# EAGLE design WaldoRevB (EAGLE 7.6.0)
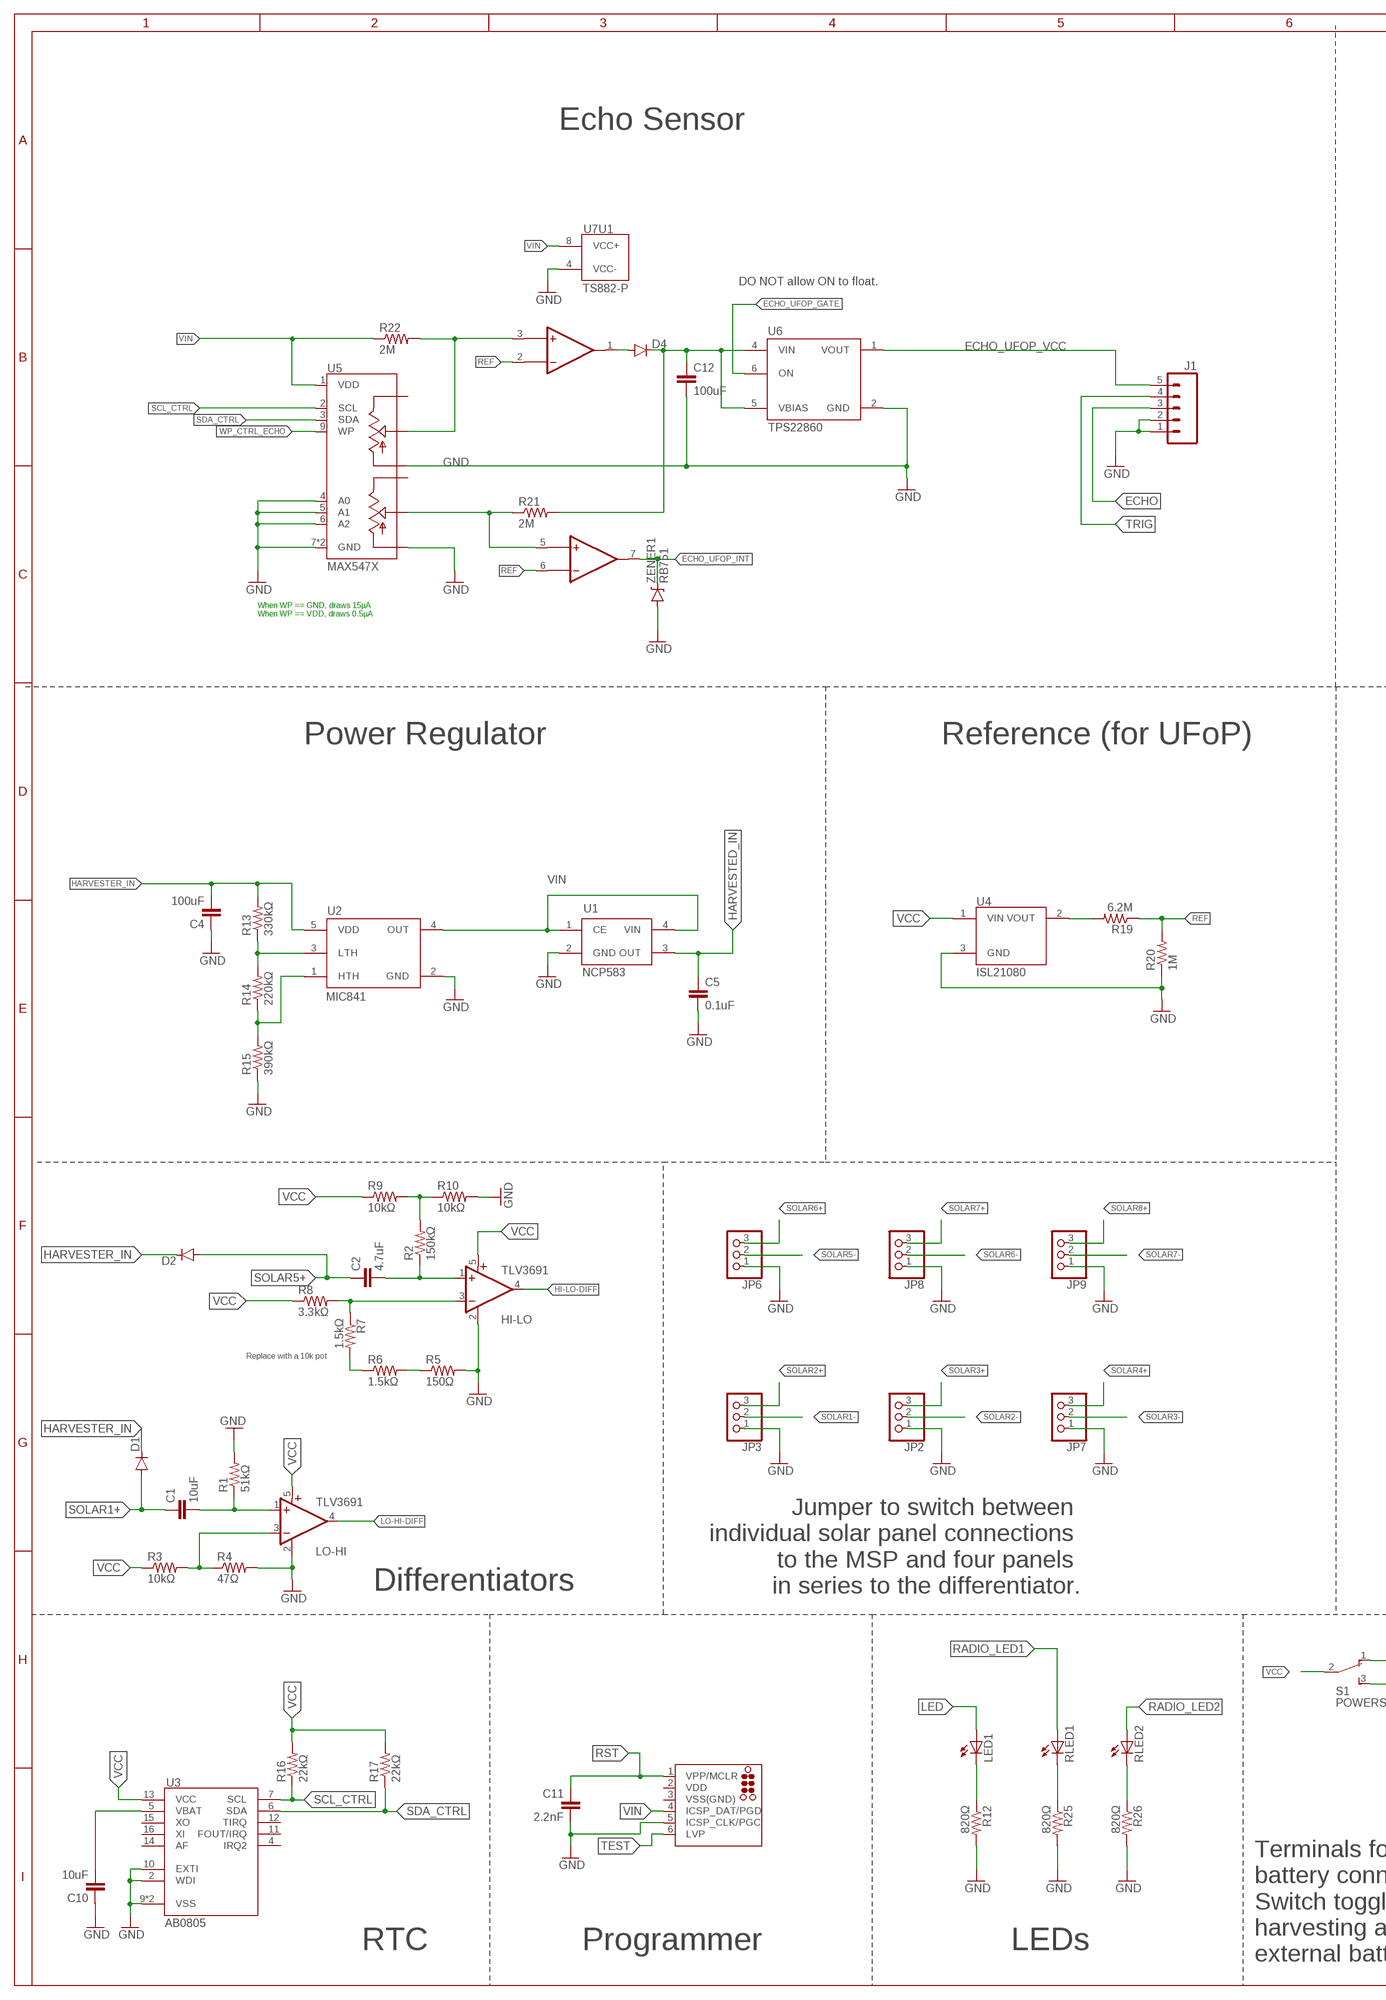
[diagram p0: schematic, sheet 1, part 1 of 2]
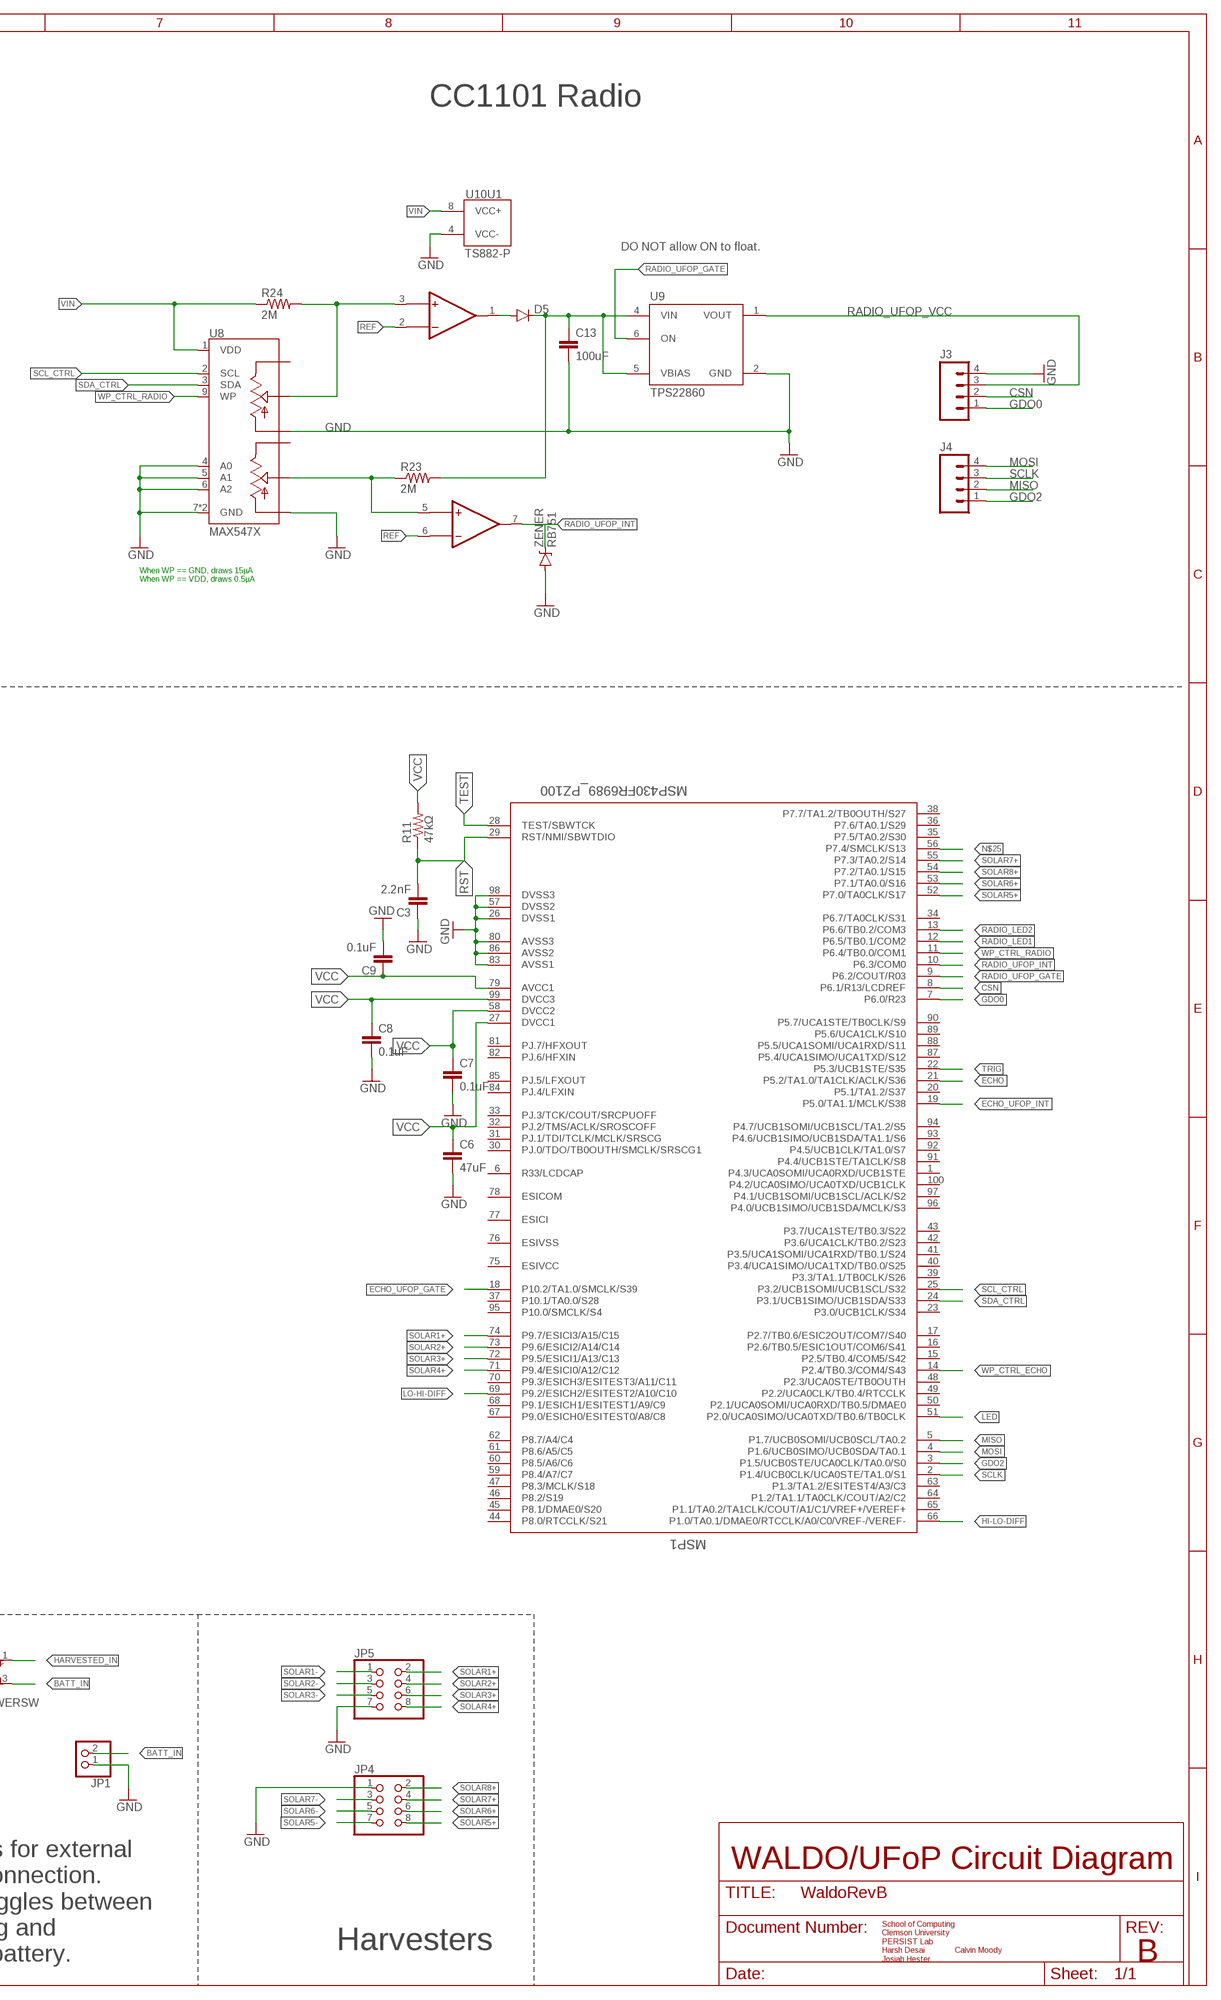
[diagram p1: schematic, sheet 1, part 2 of 2]

## Parts
C1  10uF  CAP0805  [0805]
C2  4.7uF  CAP0805  [0805]
C3  2.2nF  CAP0805  [0805]
C4  100uF  CAP0805  [0805]
C5  0.1uF  CAP0805  [0805]
C6  47uF  CAP0805  [0805]
C7  0.1uF  CAP0805  [0805]
C8  0.1uF  CAP0805  [0805]
C9  0.1uF  CAP0805  [0805]
C10  10uF  CAP0805  [0805]
C11  2.2nF  CAP0805  [0805]
C12  100uF  CAP0805  [0805]
C13  100uF  CAP0805  [0805]
D1  DIODESOD523  [SOD523]
D2  DIODESOD523  [SOD523]
D4  DIODESOD523  [SOD523]
D5  DIODESOD523  [SOD523]
HI-LO  TLV3691  [SC70-5]
J1  M05PTH  [1X05]
J2  TC2030-MCP-NL  [TC2030-MCP-NL]
J3  M04PTH  [1X04]
J4  M04PTH  [1X04]
JP1  PINHD-1X2  [1X02]
JP2  PINHD-1X3  [1X03]
JP3  PINHD-1X3  [1X03]
JP4  PINHD-2X4  [2X04]
JP5  PINHD-2X4  [2X04]
JP6  PINHD-1X3  [1X03]
JP7  PINHD-1X3  [1X03]
JP8  PINHD-1X3  [1X03]
JP9  PINHD-1X3  [1X03]
LED1  LEDCHIP-LED0805  [CHIP-LED0805]
LO-HI  TLV3691  [SC70-5]
MSP1  MSP430FR6989_PZ100  [PZ100]
R1  51kΩ  RESISTOR0805-RES  [0805]
R2  150kΩ  RESISTOR0805-RES  [0805]
R3  10kΩ  RESISTOR0805-RES  [0805]
R4  47Ω  RESISTOR0805-RES  [0805]
R5  150Ω  RESISTOR0805-RES  [0805]
R6  1.5kΩ  RESISTOR0805-RES  [0805]
R7  1.5kΩ  RESISTOR0805-RES  [0805]
R8  3.3kΩ  RESISTOR0805-RES  [0805]
R9  10kΩ  RESISTOR0805-RES  [0805]
R10  10kΩ  RESISTOR0805-RES  [0805]
R11  47kΩ  RESISTOR0805-RES  [0805]
R12  820Ω  RESISTOR0805-RES  [0805]
R13  330kΩ  RESISTOR0805-RES  [0805]
R14  220kΩ  RESISTOR0805-RES  [0805]
R15  390kΩ  RESISTOR0805-RES  [0805]
R16  22kΩ  RESISTOR0805-RES  [0805]
R17  22kΩ  RESISTOR0805-RES  [0805]
R19  6.2M  RESISTOR0805-RES  [0805]
R20  1M  RESISTOR0805-RES  [0805]
R21  2M  RESISTOR0805-RES  [0805]
R22  2M  RESISTOR0805-RES  [0805]
R23  2M  RESISTOR0805-RES  [0805]
R24  2M  RESISTOR0805-RES  [0805]
R25  820Ω  RESISTOR0805-RES  [0805]
R26  820Ω  RESISTOR0805-RES  [0805]
RLED1  LEDCHIP-LED0805  [CHIP-LED0805]
RLED2  LEDCHIP-LED0805  [CHIP-LED0805]
S1  POWERSW  [TL3XYO]
U1  NCP583  [SC82-AB_1PRIMARY]
U2  MIC841  [SC70-5]
U3  AB0805  [QFN16]
U4  ISL21080  [SOT-23]
U5  MAX547X  [QFN16]
U6  TPS22860  [TSOT23-6]
U7  TS882-P  [UDFN8]
U8  MAX547X  [QFN16]
U9  TPS22860  [TSOT23-6]
U10  TS882-P  [UDFN8]
ZENER  RB751  DIODE-ZENER  [SOD-523]
ZENER1  RB751  DIODE-ZENER  [SOD-523]

## Nets
BATT_IN: JP1.2 S1.3(S)
CSN: J3.2 MSP1.8(P6.1/R13/LCDREF)
ECHO: J1.3 MSP1.21(P5.2/TA1.0/TA1CLK/ACLK/S36)
ECHO_UFOP_GATE: MSP1.18(P10.2/TA1.0/SMCLK/S39) U6.6(ON)
ECHO_UFOP_INT: MSP1.19(P5.0/TA1.1/MCLK/S38) U7.7(OP2:OUT1) ZENER1.CATHODE(C)
ECHO_UFOP_VCC: J1.5 U6.1(VOUT)
GDO0: J3.1 MSP1.7(P6.0/R23)
GDO2: J4.1 MSP1.3(P1.5/UCB0STE/UCA0CLK/TA0.0/S0)
GND: C3.1 C4.1 C5.2 C6.2 C7.2 C8.2 C9.2 C10.1 C11.2 C12.2 C13.2 HI-LO.2(GND) J1.1 J1.2 J2.5(ICSP_CLK/PGC) J3.4 JP1.1 JP2.1 JP3.1 JP4.1 JP5.7 JP6.1 JP7.1 JP8.1 JP9.1 LO-HI.2(GND) MSP1.26(DVSS1) MSP1.57(DVSS2) MSP1.80(AVSS3) MSP1.83(AVSS1) MSP1.86(AVSS2) MSP1.98(DVSS3) R1.2 R4.2 R5.2 R10.2 R12.2 R15.1 R20.1 R25.2 R26.2 U1.2(GND) U2.2(GND) U3.2(WDI) U3.9(VSS) U3.10(EXTI) U3.TH(VSS) U4.3(GND) U5.4(A0) U5.5(A1) U5.6(A2) U5.7(GND) U5.10(LB) U5.13(LA) U5.TH(GND) U6.2(GND) U7.4(U1:VCC-) U8.4(A0) U8.5(A1) U8.6(A2) U8.7(GND) U8.10(LB) U8.13(LA) U8.TH(GND) U9.2(GND) U10.4(U1:VCC-) ZENER1.ANODE(A) ZENER.ANODE(A)
HARVESTED_IN: C5.1 S1.1(O) U1.3(OUT)
HARVESTER_IN: C4.2 D1.C D2.C R13.2 U2.5(VDD)
HI-LO-DIFF: HI-LO.4(OUT) MSP1.66(P1.0/TA0.1/DMAE0/RTCCLK/A0/C0/VREF-/VEREF-)
LED: LED1.A MSP1.51(P2.0/UCA0SIMO/UCA0TXD/TB0.6/TB0CLK)
LO-HI-DIFF: LO-HI.4(OUT) MSP1.69(P9.2/ESICH2/ESITEST2/A10/C10)
MISO: J4.2 MSP1.5(P1.7/UCB0SOMI/UCB0SCL/TA0.2)
MOSI: J4.4 MSP1.4(P1.6/UCB0SIMO/UCB0SDA/TA0.1)
N$1: C1.2 LO-HI.1(+IN) R1.1
N$2: C2.2 HI-LO.1(+IN) R2.1
N$3: LO-HI.3(-IN) R3.2 R4.1
N$4: R5.1 R6.2
N$5: R6.1 R7.2
N$6: HI-LO.3(-IN) R7.1 R8.2
N$7: LED1.C R12.1
N$8: R2.2 R9.2 R10.1
N$9: R25.1 RLED1.C
N$11: R13.1 R14.2 U2.3(LTH)
N$12: R14.1 R15.2 U2.1(HTH)
N$13: C10.2 U3.5(VBAT)
N$14: R19.2 U4.2(VOUT)
N$16: R22.2 U5.14(WA) U7.3(OP1:IN1+)
N$17: C12.1 D4.C R21.2 U6.4(VIN) U6.5(VBIAS)
N$18: R21.1 U5.11(WB) U7.5(OP2:IN1+)
N$20: D4.A U7.1(OP1:OUT1)
N$21: R24.2 U8.14(WA) U10.3(OP1:IN1+)
N$22: C13.1 D5.C R23.2 U9.4(VIN) U9.5(VBIAS)
N$23: R23.1 U8.11(WB) U10.5(OP2:IN1+)
N$24: D5.A U10.1(OP1:OUT1)
N$25: MSP1.56(P7.4/SMCLK/S13)
RADIO_LED1: MSP1.12(P6.5/TB0.1/COM2) RLED1.A
RADIO_LED2: MSP1.13(P6.6/TB0.2/COM3) RLED2.A
RADIO_UFOP_GATE: MSP1.9(P6.2/COUT/R03) U9.6(ON)
RADIO_UFOP_INT: MSP1.10(P6.3/COM0) U10.7(OP2:OUT1) ZENER.CATHODE(C)
RADIO_UFOP_VCC: J3.3 U9.1(VOUT)
REF: R19.1 R20.2 U7.2(OP1:IN1-) U7.6(OP2:IN1-) U10.2(OP1:IN1-) U10.6(OP2:IN1-)
RLED2: R26.1 RLED2.C
RST: C3.2 C11.1 J2.1(VPP/MCLR) MSP1.29(RST/NMI/SBWTDIO) R11.1
SCL_CTRL: MSP1.25(P3.2/UCB1SOMI/UCB1SCL/S32) R16.1 U3.7(SCL) U5.2(SCL) U8.2(SCL)
SCLK: J4.3 MSP1.2(P1.4/UCB0CLK/UCA0STE/TA1.0/S1)
SDA_CTRL: MSP1.24(P3.1/UCB1SIMO/UCB1SDA/S33) R17.1 U3.6(SDA) U5.3(SDA) U8.3(SDA)
SOLAR1+: C1.1 D1.A JP5.2 MSP1.74(P9.7/ESICI3/A15/C15)
SOLAR1-: JP3.2 JP5.1
SOLAR2+: JP3.3 JP5.4 MSP1.73(P9.6/ESICI2/A14/C14)
SOLAR2-: JP2.2 JP5.3
SOLAR3+: JP2.3 JP5.6 MSP1.72(P9.5/ESICI1/A13/C13)
SOLAR3-: JP5.5 JP7.2
SOLAR4+: JP5.8 JP7.3 MSP1.71(P9.4/ESICI0/A12/C12)
SOLAR5+: C2.1 D2.A JP4.8 MSP1.52(P7.0/TA0CLK/S17)
SOLAR5-: JP4.7 JP6.2
SOLAR6+: JP4.6 JP6.3 MSP1.53(P7.1/TA0.0/S16)
SOLAR6-: JP4.5 JP8.2
SOLAR7+: JP4.4 JP8.3 MSP1.55(P7.3/TA0.2/S14)
SOLAR7-: JP4.3 JP9.2
SOLAR8+: JP4.2 JP9.3 MSP1.54(P7.2/TA0.1/S15)
TEST: J2.6(LVP) MSP1.28(TEST/SBWTCK)
TRIG: J1.4 MSP1.22(P5.3/UCB1STE/S35)
VCC: C6.1 C7.1 C8.1 C9.1 HI-LO.5(V+) LO-HI.5(V+) MSP1.27(DVCC1) MSP1.58(DVCC2) MSP1.79(AVCC1) MSP1.99(DVCC3) R3.1 R8.1 R9.1 R11.2 R16.2 R17.2 S1.2(P) U3.13(VCC) U4.1(VIN)
VIN: J2.4(ICSP_DAT/PGD) R22.1 R24.1 U1.1(CE) U1.4(VIN) U2.4(OUT) U5.1(VDD) U7.8(U1:VCC+) U8.1(VDD) U10.8(U1:VCC+)
WP_CTRL_ECHO: MSP1.14(P2.4/TB0.3/COM4/S43) U5.9(WP)
WP_CTRL_RADIO: MSP1.11(P6.4/TB0.0/COM1) U8.9(WP)
Unconnected: MSP1.1(P4.3/UCA0SOMI/UCA0RXD/UCB1STE) MSP1.6(R33/LCDCAP) MSP1.15(P2.5/TB0.4/COM5/S42) MSP1.16(P2.6/TB0.5/ESIC1OUT/COM6/S41) MSP1.17(P2.7/TB0.6/ESIC2OUT/COM7/S40) MSP1.20(P5.1/TA1.2/S37) MSP1.23(P3.0/UCB1CLK/S34) MSP1.30(PJ.0/TDO/TB0OUTH/SMCLK/SRSCG1) MSP1.31(PJ.1/TDI/TCLK/MCLK/SRSCG) MSP1.32(PJ.2/TMS/ACLK/SROSCOFF) MSP1.33(PJ.3/TCK/COUT/SRCPUOFF) MSP1.34(P6.7/TA0CLK/S31) MSP1.35(P7.5/TA0.2/S30) MSP1.36(P7.6/TA0.1/S29) MSP1.37(P10.1/TA0.0/S28) MSP1.38(P7.7/TA1.2/TB0OUTH/S27) MSP1.39(P3.3/TA1.1/TB0CLK/S26) MSP1.40(P3.4/UCA1SIMO/UCA1TXD/TB0.0/S25) MSP1.41(P3.5/UCA1SOMI/UCA1RXD/TB0.1/S24) MSP1.42(P3.6/UCA1CLK/TB0.2/S23) MSP1.43(P3.7/UCA1STE/TB0.3/S22) MSP1.44(P8.0/RTCCLK/S21) MSP1.45(P8.1/DMAE0/S20) MSP1.46(P8.2/S19) MSP1.47(P8.3/MCLK/S18) MSP1.48(P2.3/UCA0STE/TB0OUTH) MSP1.49(P2.2/UCA0CLK/TB0.4/RTCCLK) MSP1.50(P2.1/UCA0SOMI/UCA0RXD/TB0.5/DMAE0) MSP1.59(P8.4/A7/C7) MSP1.60(P8.5/A6/C6) MSP1.61(P8.6/A5/C5) MSP1.62(P8.7/A4/C4) MSP1.63(P1.3/TA1.2/ESITEST4/A3/C3) MSP1.64(P1.2/TA1.1/TA0CLK/COUT/A2/C2) MSP1.65(P1.1/TA0.2/TA1CLK/COUT/A1/C1/VREF+/VEREF+) MSP1.67(P9.0/ESICH0/ESITEST0/A8/C8) MSP1.68(P9.1/ESICH1/ESITEST1/A9/C9) MSP1.70(P9.3/ESICH3/ESITEST3/A11/C11) MSP1.75(ESIVCC) MSP1.76(ESIVSS) MSP1.77(ESICI) MSP1.78(ESICOM) MSP1.81(PJ.7/HFXOUT) MSP1.82(PJ.6/HFXIN) MSP1.84(PJ.4/LFXIN) MSP1.85(PJ.5/LFXOUT) MSP1.87(P5.4/UCA1SIMO/UCA1TXD/S12) MSP1.88(P5.5/UCA1SOMI/UCA1RXD/S11) MSP1.89(P5.6/UCA1CLK/S10) MSP1.90(P5.7/UCA1STE/TB0CLK/S9) MSP1.91(P4.4/UCB1STE/TA1CLK/S8) MSP1.92(P4.5/UCB1CLK/TA1.0/S7) MSP1.93(P4.6/UCB1SIMO/UCB1SDA/TA1.1/S6) MSP1.94(P4.7/UCB1SOMI/UCB1SCL/TA1.2/S5) MSP1.95(P10.0/SMCLK/S4) MSP1.96(P4.0/UCB1SIMO/UCB1SDA/MCLK/S3) MSP1.97(P4.1/UCB1SOMI/UCB1SCL/ACLK/S2) MSP1.100(P4.2/UCA0SIMO/UCA0TXD/UCB1CLK) U3.4(IRQ2) U3.11(FOUT/IRQ) U3.12(TIRQ) U3.14(AF) U3.15(XO) U3.16(XI) U5.12(HB) U5.15(HA) U8.12(HB) U8.15(HA)

## Notes on the sheet
- CC1101 Radio
- Echo Sensor
- DO NOT allow ON to float.
- DO NOT allow ON to float.
- When WP == GND, draws 15µA
  When WP == VDD, draws 0.5µA
- When WP == GND, draws 15µA
  When WP == VDD, draws 0.5µA
- Power Regulator | Reference (for UFoP)
- Replace with a 10k pot
- Jumper to switch between 
  individual solar panel connections 
  to the MSP and four panels 
  in series to the differentiator.
- Differentiators
- WALDO/UFoP Circuit Diagram
- RTC | Programmer | LEDs | Harvesters
- Terminals for external
  battery connection.
  Switch toggles between
  harvesting and 
  external battery.
- School of Computing
  Clemson University
  PERSIST Lab
  Harsh Desai               Calvin Moody
  Josiah Hester
- B

## Power pins joined to a net without a drawn wire
VDD: J2.2(VDD)
VSS(GND): J2.3(VSS(GND))

## Library data of the parts
C1-C11 = SparkFun-Capacitors:CAP: Capacitor Standard 0603 ceramic capacitor, and 0.1" leaded capacitor.
C12 C13 = SparkFun-Capacitors:CAP: Capacitor Standard 0603 ceramic capacitor, and 0.1" leaded capacitor.; DIGIKEY: 490-9969-1-ND
D1 D2 D4 D5 = SparkFun-DiscreteSemi:DIODE: Diode These are standard reverse protection diodes and small signal diodes. SMA package can handle up to about 1A. SOD-323 can handle about 200mA. What the SOD-323 package when ordering, there are some mfgs out there that are 5-pin packages.
HI-LO LO-HI = fedpower:TLV3691: 0.9-V to 6.5-V, Nanopower Comparator Datasheets Analog Signal Chain Guide <http://www.ti.com/lit/pdf/slyb174> TLV3691 <http://www.ti.com/lit/ds/symlink/tlv3691.pdf> Manufacturer Product Page TLV3691IDPFR Specifications <http://www.ti.com/general/docs/suppproductinfo.tsp?distId=10&orderablePartNumber=TLV3691IDPFR> Standard Package <javascript:dlgHelp('Standard%20Packaging%20Help');> 1 Category Integrated Circuits (ICs) </product-search/en/integrated-circuits-ics> Family Linear - Comparators </product-search/en/integrated-circuits-ics/linear-comparators/2556221> Series - Packaging <javascript:dlgHelp('Standard%20Packaging%20Help');> Cut Tape (CT) <javascript:dlgHelp('Cut%20Tape%20Help');> Type General Purpose Number of Elements 1 Output Type Push-Pull Voltage - Supply, Single/Dual (±) 0.9 V ~ 6.5 V, ±0.45 V ~ 3.25 V Voltage - Input Offset (Max) 3mV Current - Input Bias (Max) 100pA Current - Output (Typ) 42mA Current - Quiescent (Max) 150nA CMRR, PSRR (Typ) - Propagation Delay (Max) 35µs Hysteresis - Operating Temperature -40°C ~ 125°C Package / Case 6-XFDFN Mounting Type Surface Mount Supplier Device Package 6-X2SON (1x1) Online Catalog Comparators - 1 element </catalog/en/partgroup/comparators-1-element/3112?mpart=TLV3691IDPFR&vendor=296&WT.z_ref_page_type=PS&WT.z_ref_page_sub_type=PD&WT.z_ref_page_id=PD&WT.z_ref_page_event=DC_Link_Table> Other Names 296-37242-1
J1 = SparkFun-Connectors:M05: Header 5 Standard 5-pin 0.1" header. Use with straight break away headers (SKU : PRT-00116), right angle break away headers (PRT-00553), swiss pins (PRT-00743), machine pins (PRT-00117), and female headers (PRT-00115). Molex polarized connector foot print use with SKU : PRT-08230 with associated crimp pins and housings.
J2 = tag-connect_msp430:TC2030: TAG-CONNECT ICSP Connector Manufacturer: Tag-Connect <http://www.tag-connect.com> Cable for easy In-Circuit Serial Programming. Designed for Microchip ICD2, suitable for many others. Two variants - one "with legs" (for hands-free fit on PCB) and another "without legs" for quick programming. PAD Description 1 MCLR/Vpp 2 Vdd 3 GND 4 PGD (ISPDAT) 5 PGC (ISPCLK) 6 nc (used for LVP) ©2009 ROFA.cz - modified and updated by Robert Darlington ‹rdarlington@gmail.com›
J3 J4 = SparkFun-Connectors:M04: Header 4 Standard 4-pin 0.1" header. Use with straight break away headers (SKU : PRT-00116), right angle break away headers (PRT-00553), swiss pins (PRT-00743), machine pins (PRT-00117), and female headers (PRT-00115). Molex polarized connector foot print use with SKU : PRT-08231 with associated crimp pins and housings. 1MM SMD Version SKU: PRT-10208; PROD_ID: CONN-09696
JP1 = pinhead:PINHD-1X2: PIN HEADER
JP2 JP3 JP6-JP9 = pinhead:PINHD-1X3: PIN HEADER
JP4 JP5 = pinhead:PINHD-2X4: PIN HEADER
LED1 RLED1 RLED2 = led:LED: LED OSRAM: - CHIPLED LG R971, LG N971, LY N971, LG Q971, LY Q971, LO R971, LY R971 LH N974, LH R974 LS Q976, LO Q976, LY Q976 LO Q996 - Hyper CHIPLED LW Q18S LB Q993, LB Q99A, LB R99A - SideLED LS A670, LO A670, LY A670, LG A670, LP A670 LB A673, LV A673, LT A673, LW A673 LH A674 LY A675 LS A676, LA A676, LO A676, LY A676, LW A676 LS A679, LY A679, LG A679 - Hyper Micro SIDELED® LS Y876, LA Y876, LO Y876, LY Y876 LT Y87S - SmartLED LW L88C, LW L88S LB L89C, LB L89S, LG L890 LS L89K, LO L89K, LY L89K LS L896, LA L896, LO L896, LY L896 - TOPLED LS T670, LO T670, LY T670, LG T670, LP T670 LSG T670, LSP T670, LSY T670, LOP T670, LYG T670 LG T671, LOG T671, LSG T671 LB T673, LV T673, LT T673, LW T673 LH T674 LS T676, LA T676, LO T676, LY T676, LB T676, LH T676, LSB T676, LW T676 LB T67C, LV T67C, LT T67C, LS T67K, LO T67K, LY T67K, LW E67C LS E67B, LA E67B, LO E67B, LY E67B, LB E67C, LV E67C, LT E67C LW T67C LS T679, LY T679, LG T679 LS T770, LO T770, LY T770, LG T770, LP T770 LB T773, LV T773, LT T773, LW T773 LH T774 LS E675, LA E675, LY E675, LS T675 LS T776, LA T776, LO T776, LY T776, LB T776 LHGB T686 LT T68C, LB T68C - Hyper Mini TOPLED® LB M676 - Mini TOPLED Santana® LG M470 LS M47K, LO M47K, LY M47K Source: http://www.osram.convergy.de LUXEON: - LUMILED® LXK2-PW12-R00, LXK2-PW12-S00, LXK2-PW14-U00, LXK2-PW14-V00 LXK2-PM12-R00, LXK2-PM12-S00, LXK2-PM14-U00 LXK2-PE12-Q00, LXK2-PE12-R00, LXK2-PE12-S00, LXK2-PE14-T00, LXK2-PE14-U00 LXK2-PB12-K00, LXK2-PB12-L00, LXK2-PB12-M00, LXK2-PB14-N00, LXK2-PB14-P00, LXK2-PB14-Q00 LXK2-PR12-L00, LXK2-PR12-M00, LXK2-PR14-Q00, LXK2-PR14-R00 LXK2-PD12-Q00, LXK2-PD12-R00, LXK2-PD12-S00 LXK2-PH12-R00, LXK2-PH12-S00 LXK2-PL12-P00, LXK2-PL12-Q00, LXK2-PL12-R00 Source: www.luxeon.com KINGBRIGHT: KA-3528ASYC Source: www.kingbright.com
MSP1 = msp430:MSP430FR6989_PZ100
R1-R17 R22 R24-R26 = SparkFun-Resistors:RESISTOR: Resistor Basic schematic elements and footprints for 0603, 1206, and PTH resistors.
R19 = SparkFun-Resistors:RESISTOR: Resistor Basic schematic elements and footprints for 0603, 1206, and PTH resistors.; DIGIKEY: 541-6.20MHCT-ND
R20 = SparkFun-Resistors:RESISTOR: Resistor Basic schematic elements and footprints for 0603, 1206, and PTH resistors.; DIGIKEY: 311-1.00MHRCT-ND
R21 R23 = SparkFun-Resistors:RESISTOR: Resistor Basic schematic elements and footprints for 0603, 1206, and PTH resistors.; DIGIKEY: 311-2.00MHRCT-ND
S1 = GreenBoard:POWERSW: TINY SWITCH ON - ON Source: http://www2.produktinfo.conrad.com/datenblaetter/700000-724999/705152-da-01-de-Subminiaturschalter_TL_36YO.pdf
U1 = ncp583:NCP583: NCP583 - Ultra-Low Iq 150 mA CMOS LDO Regulator with Enable The NCP583 series of low dropout regulators are designed for portable battery powered applications which require precise output voltage accuracy and low quiescent current. These devices feature an enable function which lowers current consumption significantly and are offered in two small packages; SC−82AB and the SOT−563. A 1.0 mF ceramic capacitor is the recommended value to be used with these devices on the output pin.
U2 = mic841:MIC841: MIC841:Comparator with reference and adj. hysteresis
U3 = AB08XX:AB0805: AB08X5 Real-Time Clock Family: I2C Version The ABRACON AB08X5 Real-Time Clock family provides a groundbreaking combination of ultra-low power coupled with a highly sophisticated feature set. With power requirements significantly lower than any other industry RTC (as low as 14 nA), these are the first semiconductors based on innovative SPOTTM (Subthreshold Power Optimized Technology) CMOS platform. The AB08X5 includes on-chip oscillators to provide minimum power consumption, full RTC functions including battery backup and programmable counters and alarms for timer and watchdog functions, and either an I2C or SPI serial interface for communication with a host controller.; MOUSER: 815-AB0805-T3
U4 = isl21080:ISL21080: Intersil: ISL21080, 300nA NanoPower Voltage References The ISL21080 analog voltage references feature low supply voltage operation at ultra-low 310nA typ, 1.5µA max operating current. Additionally, the ISL21080 family features guaranteed initial accuracy as low as ±0.2% and 50ppm/°C temperature coefficient. These references are ideal for general purpose portable applications to extend battery life at lower cost. The ISL21080 is provided in the industry standard 3 Ld SOT-23 pinout. The ISL21080 output voltages can be used as precision voltage sources for voltage monitors, control loops, standby voltages for low power states for DSP, FPGA, Datapath Controllers, microcontrollers and other core voltages: 0.9V, 1.024V, 1.25V, 1.5V, 2.048V, 2.5V, 3.0V, 3.3V, 4.096V and 5.0V. Special Note: Post-assembly x-ray inspection may lead to permanent changes in device output voltage and should be minimized or avoided. For further information, please see “Applications Information” on page 14 and AN1533, “X-Ray Effects on Intersil FGA References”.; DIGIKEY: ISL21080DIH309Z-TKCT-ND
U5 U8 = max547x:MAX547X: MAXIM MAX547X: Dual, 256-Tap, Nonvolatile, I2C-Interface, Digital Potentiometers, 400nA Iq, 250µA 12ms write The MAX5477/MAX5478/MAX5479 nonvolatile, dual, linear-taper, digital potentiometers perform the function of a mechanical potentiometer, but replace the mechanics with a simple 2-wire digital interface. Each device performs the same function as a discrete potentiometer or variable resistor and has 256 tap points. The devices feature an internal, nonvolatile EEPROM used to store the wiper position for initialization during power-up. A write-protect feature prevents accidental overwrites of the EEPROM. The fast-mode I2C-compatible serial interface allows communication at data rates up to 400kbps, minimizing board space and reducing interconnection complexity in many applications. Three address inputs allow a total of eight unique address combinations.; DIGIKEY: MAX5479ETE+-ND
U6 U9 = tps22860:TPS22860: TI: TPS22860 Ultra-Low Leakage Load Switch The TPS22860 is a small, ultra-low leakage current, single channel load switch. The device requires a VBIAS voltage and can operate over an input voltage range of 0 V to VBIAS. It can support a maximum continuous current of 200 mA. The switch is controlled by an on/off input (ON), which is capable of interfacing directly with low-voltage control signals. The TPS22860 is available in two small, space-saving 6-pin SOT-23 and SC70 packages. The device is characterized for operation over the free-air temperature range of –40°C to 85°C.; DIGIKEY: 296-43982-1-ND
U7 U10 = ts882:TS882-P; DIGIKEY: 497-14073-1-ND
ZENER ZENER1 = Parts:DIODE-ZENER: Zener Diode Production Part - 8199 3.4V Zener Voltage

## Board
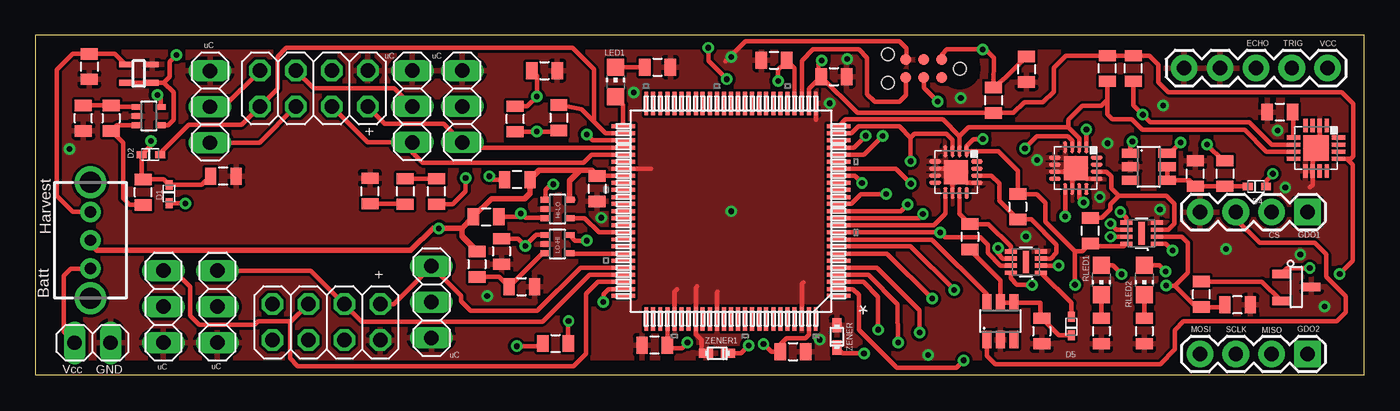
[diagram p2: board, top side]
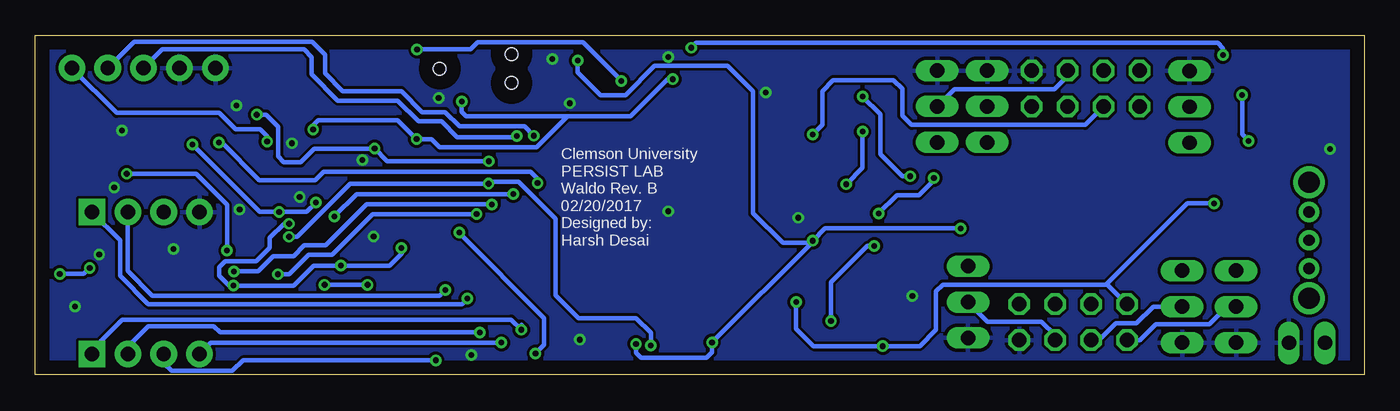
[diagram p3: board, bottom side, seen from below]

Size 94 x 24 mm. Coordinates in mm from the lower left corner, seen from the top.
Outline: 0,0 94,0 94,24 0,24 0,0
Copper layers (1*16): Top 0.035mm / dielectric 1.5mm / Bottom 0.035mm
Design rules "default": minimum track width 10mil, minimum drill 24mil, track to track 8mil, track to pad 8mil, pad to pad 8mil, via to via 8mil, smd to smd 8mil, copper to edge 40mil, drill to drill 8mil, minimum pad ring 10mil, minimum via ring 8mil, stop-mask expansion 4mil, vias tented up to drill 0mil, thermal gap 10mil

### Footprints (pad centres in the part's own frame; a part is rotated, then mirrored left to right if it is on the bottom)
0805 = smd 0.8 x 1.2: 1 -0.9,0; 2 0.9,0
SOD523 = smd 0.7 x 0.5: A 0.7,0; C -0.6,0
SC70-5 = smd 0.4 x 0.7: 1 -0.65,-0.85; 2 0,-0.85; 3 0.65,-0.85; 4 0.65,0.85; 5 -0.65,0.85
1X05 = drill 1.016 pad 1.88: 1 0,0; 2 2.54,0; 3 5.08,0; 4 7.62,0; 5 10.16,0
TC2030-MCP-NL = smd 0.787 x 0.787: 1 1.27,-0.635; 2 1.27,0.635; 3 2.54,-0.635; 4 2.54,0.635; 5 3.81,-0.635; 6 3.81,0.635 | hole 0.889: 0,0; 5.08,-1.016; 5.08,1.016
1X04 = drill 1.016 pad 1.88 square: 1 0,0 | drill 1.016 pad 1.88: 2 2.54,0; 3 5.08,0; 4 7.62,0
1X02 = drill 1.016 long: 1 -1.27,0; 2 1.27,0
1X03 = drill 1.016 long: 1 -2.54,0; 2 0,0; 3 2.54,0
2X04 = drill 1.016 octagon: 1 -3.81,-1.27; 2 -3.81,1.27; 3 -1.27,-1.27; 4 -1.27,1.27; 5 1.27,-1.27; 6 1.27,1.27; 7 3.81,-1.27; 8 3.81,1.27
CHIP-LED0805 = smd 1.2 x 1.2: A 0,-1.05; C 0,1.05
PZ100 = smd 1.676 x 0.279: 1 -7.62,5.994; 2 -7.62,5.512; 3 -7.62,5.004; 4 -7.62,4.496; 5 -7.62,3.988; 6 -7.62,3.505; 7 -7.62,2.997; 8 -7.62,2.489; 9 -7.62,2.007; 10 -7.62,1.499; 11 -7.62,0.991; 12 -7.62,0.508; 13 -7.62,0; 14 -7.62,-0.508; 15 -7.62,-0.991; 16 -7.62,-1.499; 17 -7.62,-2.007; 18 -7.62,-2.489; 19 -7.62,-2.997; 20 -7.62,-3.505; 21 -7.62,-3.988; 22 -7.62,-4.496; 23 -7.62,-5.004; 24 -7.62,-5.512; 25 -7.62,-5.994; 51 7.62,-5.994; 52 7.62,-5.512; 53 7.62,-5.004; 54 7.62,-4.496; 55 7.62,-3.988; 56 7.62,-3.505; 57 7.62,-2.997; 58 7.62,-2.489; 59 7.62,-2.007; 60 7.62,-1.499; 61 7.62,-0.991; 62 7.62,-0.508; 63 7.62,0; 64 7.62,0.508; 65 7.62,0.991; 66 7.62,1.499; 67 7.62,2.007; 68 7.62,2.489; 69 7.62,2.997; 70 7.62,3.505; 71 7.62,3.988; 72 7.62,4.496; 73 7.62,5.004; 74 7.62,5.512; 75 7.62,5.994 | smd 0.279 x 1.676: 26 -5.994,-7.62; 27 -5.512,-7.62; 28 -5.004,-7.62; 29 -4.496,-7.62; 30 -3.988,-7.62; 31 -3.505,-7.62; 32 -2.997,-7.62; 33 -2.489,-7.62; 34 -2.007,-7.62; 35 -1.499,-7.62; 36 -0.991,-7.62; 37 -0.508,-7.62; 38 0,-7.62; 39 0.508,-7.62; 40 0.991,-7.62; 41 1.499,-7.62; 42 2.007,-7.62; 43 2.489,-7.62; 44 2.997,-7.62; 45 3.505,-7.62; 46 3.988,-7.62; 47 4.496,-7.62; 48 5.004,-7.62; 49 5.512,-7.62; 50 5.994,-7.62; 76 5.994,7.62; 77 5.512,7.62; 78 5.004,7.62; 79 4.496,7.62; 80 3.988,7.62; 81 3.505,7.62; 82 2.997,7.62; 83 2.489,7.62; 84 2.007,7.62; 85 1.499,7.62; 86 0.991,7.62; 87 0.508,7.62; 88 0,7.62; 89 -0.508,7.62; 90 -0.991,7.62; 91 -1.499,7.62; 92 -2.007,7.62; 93 -2.489,7.62; 94 -2.997,7.62; 95 -3.505,7.62; 96 -3.988,7.62; 97 -4.496,7.62; 98 -5.004,7.62; 99 -5.512,7.62; 100 -5.994,7.62
TL3XYO = drill 0.8 pad 1.422: 1 -2,0; 2 0,0; 3 2,0 | drill 1.5 pad 1.93: M1 -4.1,0; M2 4.1,0
SC82-AB_1PRIMARY = smd 0.406 x 0.914: 1 -1.321,-0.813; 2 -0.025,-0.813; 3 -0.025,1.067; 4 -1.321,1.067
QFN16 = smd 0.95 x 0.3: 1 -1.6,0.75; 2 -1.6,0.25; 3 -1.6,-0.25; 4 -1.6,-0.75; 9 1.6,-0.75; 10 1.6,-0.25; 11 1.6,0.25; 12 1.6,0.75 | smd 0.3 x 0.95: 5 -0.75,-1.6; 6 -0.25,-1.6; 7 0.25,-1.6; 8 0.75,-1.6; 13 0.75,1.6; 14 0.25,1.6; 15 -0.25,1.6; 16 -0.75,1.6 | smd 1.8 x 1.8: TH 0,0
SOT-23 = smd 0.6 x 1.25: 1 -0.95,-1.075; 2 0.95,-1.075; 3 -0.025,1.075
QFN16' = smd 0.85 x 0.3: 1 -1.475,0.75; 2 -1.475,0.25; 3 -1.475,-0.25; 4 -1.475,-0.75; 9 1.475,-0.75; 10 1.475,-0.25; 11 1.475,0.25; 12 1.475,0.75 | smd 0.3 x 0.85: 5 -0.75,-1.475; 6 -0.25,-1.475; 7 0.25,-1.475; 8 0.75,-1.475; 13 0.75,1.475; 14 0.25,1.475; 15 -0.25,1.475; 16 -0.75,1.475 | smd 1.7 x 1.7: TH 0,0
TSOT23-6 = smd 0.62 x 1.22: 1 -0.95,-1.3; 2 0,-1.3; 3 0.95,-1.3; 4 0.95,1.3; 5 0,1.3; 6 -0.95,1.3
UDFN8 = smd 0.3 x 0.85: 1 -0.75,-1.075; 2 -0.25,-1.075; 3 0.25,-1.075; 4 0.75,-1.075; 5 0.75,1.075; 6 0.25,1.075; 7 -0.25,1.075; 8 -0.75,1.075 | smd 1.6 x 0.45: TH 0,0
SOD-523 = smd 1 x 0.635: ANODE -0.8,0; CATHODE 0.76,0

### Placement (x,y rotation side)
C1  36.8,2.21 0 top
C2  37.03,18.18 270 top
C3  52.25,22.24 0 top
C4  13.3,14.04 180 top
C5  3.82,21.79 270 top
C6  56.49,21.08 0 top
C7  39.75,13.16 270 top
C8  53.6,1.63 0 top
C9  43.81,2.1 180 top
C10  88.04,18.58 0 top
C11  70.11,21.6 270 top
C12  82.05,14.23 90 top
C13  71.2,3.09 270 top
D1  9.46,12.82 270 top
D2  8.12,15.57 0 top
D4  86.36,13.31 0 top
D5  73.29,3.39 90 top
HI-LO  36.94,11.72 270 top
J1  81.26,21.68 0 top
J2  65.39,21.65 180 top
J3  90,11.5 180 top
J4  90,1.47 180 top
JP1  4.05,2.26 180 top
JP2  12.88,4.82 90 top
JP3  9.06,4.82 90 top
JP4  19.7,20.24 180 top
JP5  20.59,3.72 0 top
JP6  12.36,18.95 270 top
JP7  28.02,5.14 90 top
JP8  26.66,18.97 270 top
JP9  30.2,18.97 270 top
LED1  41.05,20.7 0 top
LO-HI  36.93,9.24 270 top
MSP1  49.21,11.57 180 top
R1  32.97,8.72 270 top
R2  33.94,18.09 90 top
R3  31.24,7.82 270 top
R4  34.41,6.23 0 top
R5  23.67,12.99 90 top
R6  26.17,12.96 270 top
R7  28.38,12.96 90 top
R8  31.88,11.16 0 top
R9  34.09,13.8 180 top
R10  36.02,21.5 0 top
R11  67.78,19.41 270 top
R12  44.02,21.75 0 top
R13  7.63,12.91 90 top
R14  5.36,18.14 270 top
R15  3.4,18.14 90 top
R16  75.83,21.66 90 top
R17  77.67,21.66 90 top
R19  82.48,5.69 90 top
R20  85.04,4.94 180 top
R21  84.15,14.23 270 top
R22  74.63,10.19 90 top
R23  66.11,9.75 270 top
R24  69.5,11.88 270 top
R25  75.41,3.09 270 top
R26  78.45,3.09 270 top
RLED1  75.41,6.7 180 top
RLED2  78.45,6.7 180 top
S1  3.9,9.51 270 top
U1  7.44,21.97 90 top
U2  8.03,18.29 270 top
U3  90.6,16.02 270 top
U4  89.2,6.18 270 top
U5  MAX547X  [QFN16']  73.6,14.61 270 top
U6  78.76,14.71 270 top
U7  78.25,10.01 90 top
U8  MAX547X  [QFN16']  65.13,14.33 270 top
U9  68.27,3.79 0 top
U10  70.07,7.97 90 top
ZENER  56.69,2.69 270 top
ZENER1  48.25,1.51 0 top

### Tracks (layer width: path | path; a pad name or v marks a point on that pad's centre or on a via)
BATT_IN
  Top 0.305: S1.3 2.51,7.51 2,7 2,3.04 JP1.2
CSN  (via drill 0.4)
  Top 0.305: MSP1.8 61.92,9.08 v65,6
  Bottom 0.305: J3.2 87.46,7.34 85.72,5.6 65.4,5.6 v65,6
ECHO  (via drill 0.4)
  Top 0.305: MSP1.21 58.62,15.56 v59.94,16.88
  Bottom 0.305: J1.3 85.02,23 75,23 74.46,22.46 74.46,21.25 72.6,19.39 68.37,19.39 66.9,17.92 65.27,17.92 64.16,16.81 60.01,16.81 v59.94,16.88
ECHO_UFOP_GATE  (via drill 0.4)
  Top 0.305: MSP1.18 57.96,14.06 v58.47,13.55 | U6.6 80.25,15.66 v81.02,16.43
  Bottom 0.305: v58.47,13.55 58.47,13.87 58.97,14.37 73.59,14.37 74.2,13.76 78.16,13.76 80.83,16.43 v81.02,16.43
ECHO_UFOP_INT  (via drill 0.4)
  Top 0.305: MSP1.19 60.88,14.57 v61.94,13.51 | U7.7 v76.05,9.76 | 50.14,1.75 v50.46,2.07 49.9,1.51 ZENER1.CATHODE
  Bottom 0.305: v76.05,9.76 75.47,9.76 71.72,13.51 v61.94,13.51 61.79,13.66 59.81,13.66 57.19,11.04 57.19,5.62 55.58,4.01 51.51,4.01 50.46,2.96 v50.46,2.07
ECHO_UFOP_VCC  (via drill 0.4)
  Top 0.305: U6.1 77.46,16.35 v77.6,16.49
  Bottom 0.305: v77.6,16.49 77.6,16.86 78.09,17.35 79.84,17.35 81.01,18.52 88.26,18.52 J1.5
GDO0  (via drill 0.4)
  Top 0.305: MSP1.7 60.26,8.57 v63.45,5.38
  Bottom 0.305: v63.45,5.38 63.83,5 86,5 88,7 88,9.5 J3.1
GDO2  (via drill 0.4)
  Top 0.305: MSP1.3 58.57,6.57 59.62,5.52 v59.62,3.18
  Bottom 0.305: 59.62,3.55 v59.62,3.18 60.34,3.9 87.85,3.9 90,1.75 J4.1
GND  (via drill 0.4)
  Top 0.305: U8.10 64.88,14.08 U8.TH | U8.6 64.88,14.58 U8.TH | U8.13 65.88,13.58 U8.TH | U5.10 73.35,14.06 U5.TH | U5.7 73.35,14.36 U5.TH | U5.13 74.35,13.86 U5.TH | 48.27,5.88 48.22,5.83 MSP1.86 | 46.82,6.26 46.72,6.16 MSP1.83 46.72,2.87 47.12,2.47 47.12,1.79 | MSP1.80 45.22,5.87 45.39,6.04 | MSP1.98 54.21,6.44 54.32,6.55 | MSP1.57 43.56,14.57 | MSP1.26 55.2,18.06 55.22,18.04 | U3.2 90.85,16.27 U3.TH 90.35,15.77 U3.10 90.35,13.43 90.17,13.25 | 48.83,22.18 50.23,23.58 61.13,23.58 61.61,23.1 61.61,22.32 J2.5
  other vias: 2.42,15.97 31.96,5.56 40.03,11.1 49.22,11.56 63.15,1.4 91.2,4.82 79.77,19.05 65.47,19.56 75.86,16.37 57.44,22.34 75.3,12.57 87.87,17.26 88.42,13.25 79.55,11.69 56.2,19.2 70.07,9.77 70.86,15.18 49.22,22.47 84.24,8.88 89.48,8.51 55.49,2.48 42.33,19.97
  pour Top: -1,26 -0.95,-2.31 102.05,-2.31 102,26
  pour Bottom: -1,25 -1,-1 103,-1 103,6 103,25
HARVESTED_IN
  Top 0.305: S1.1 2.66,11.51 1.52,12.65 1.52,21.55 2.66,22.69 C5.1 5.63,22.69 U1.3
HARVESTER_IN  (via drill 0.4)
  Top 0.305: U2.5 8.88,19.53 v8.63,19.78 | v8.18,16.54 8.18,16.23 D2.C 7.52,13.92 R13.2 9.07,13.81 D1.C 11.78,13.42 C4.2
  Bottom 0.305: v8.63,19.78 8.63,16.99 v8.18,16.54
HI-LO-DIFF
  Top 0.305: HI-LO.4 38.86,11.07 39.86,10.07 MSP1.66
LED
  Top 0.305: MSP1.51 41.59,19.11 LED1.A
LO-HI-DIFF
  Top 0.305: MSP1.69 37.8,8.57 LO-HI.4
MISO  (via drill 0.4)
  Top 0.305: MSP1.5 59.52,7.58 62.54,4.56 v62.54,3 v62.55,2.99
  Bottom 0.305: v62.55,2.99 80.94,2.99 81.37,3.42 86.01,3.42 87.46,1.97 J4.2
MOSI  (via drill 0.4)
  Top 0.305: MSP1.4 58.93,7.07 61,5 v61.03,2.27
  Bottom 0.305: v61.03,2.27 81.58,2.27 J4.4
N$1  (via drill 0.4)
  Top 0.305: C1.2 37.7,3.79 v37.72,3.81 | LO-HI.1 35.43,9.89 v34.65,9.11 34.14,9.62 R1.1
  Bottom 0.305: v37.72,3.81 37.72,6.53 35.14,9.11 v34.65,9.11
N$2  (via drill 0.4)
  Top 0.305: R2.1 v35.48,17.19 36.94,17.19 C2.2 | v36.64,13.47 36.49,13.47 36.09,13.07 HI-LO.1
  Bottom 0.305: v35.48,17.19 35.48,14.63 v36.64,13.47
N$3
  Top 0.305: LO-HI.3 35.87,8.59 R4.1 32.82,6.92 R3.2
N$4
  Top 0.305: R5.1 26.42,12.09 R6.2
N$5
  Top 0.305: R6.1 R7.2
N$6  (via drill 0.4)
  Top 0.305: HI-LO.3 36.07,11.09 34.67,11.09 v34.35,11.41 34.1,11.16 R8.2 | R7.1 29.52,12.06 30.44,12.98 v30.44,13.91
  Bottom 0.305: v30.44,13.91 30.44,13.75 31.48,12.71 33.05,12.71 v34.35,11.41
N$7
  Top 0.305: LED1.C R12.1
N$8  (via drill 0.4)
  Top 0.305: R9.2 32.35,13.8 v32.11,14.04 | R10.1 35.48,21.14 v35.48,19.67 34.8,18.99 R2.2
  Bottom 0.305: v32.11,14.04 32.66,14.04 34.23,15.61 34.23,18.42 v35.48,19.67
N$9
  Top 0.305: R25.1 RLED1.C
N$11
  Top 0.305: U2.3 5.76,17.64 R14.2 6.2,16.4 6.2,12.47 6.66,12.01 R13.1
N$12
  Top 0.305: R15.2 R14.1 5.46,18.94 U2.1
N$13
  Top 0.305: U3.5 89,18.52 C10.2
N$14
  Top 0.305: R19.2 86.77,6.59 U4.2
N$16
  Top 0.305: U5.14 75.78,14.36 76.11,14.03 76.11,13.2 76.64,12.67 | R22.2 75.43,11.09 76.03,11.69 76.03,12.06 76.64,12.67 | 76.64,12.67 79.99,12.67 80.56,12.1 80.56,10.69 80.13,10.26 U7.3
N$17
  Top 0.305: U6.5 U6.4 81.62,13.76 C12.1 R21.2 85.74,13.33 D4.C
N$18  (via drill 0.4)
  Top 0.305: U5.11 73.85,12.48 v74.15,12.18 | R21.1 84.02,15.13 v82.88,16.27 | U7.5 77.17,11.09 v76.75,11.51
  Bottom 0.305: v82.88,16.27 78.12,11.51 v76.75,11.51 74.82,11.51 v74.15,12.18
N$20  (via drill 0.4)
  Top 0.305: U7.1 79.97,9.26 v80.44,8.79 | D4.A 87.06,13.73 v87.54,14.21
  Bottom 0.305: v80.44,8.79 80.44,12.02 82.63,14.21 v87.54,14.21
N$21
  Top 0.305: U8.14 67.63,14.08 68.18,13.53 68.18,12.3 R24.2 70.47,10.98 72.24,9.21 72.24,8.62 71.84,8.22 U10.3
N$22
  Top 0.305: C13.1 71.1,4.09 71.1,5.09 U9.4 U9.5 68.27,6.69 R23.2 | C13.1 71.54,3.99 | D5.C 72.4,2.79 C13.1
N$23
  Top 0.305: U8.11 65.38,11.38 R23.1 67.42,10.65 69,9.07 U10.5
N$24
  Top 0.305: U10.1 73.29,5.08 D5.A
RADIO_LED1  (via drill 0.4)
  Top 0.305: MSP1.12 62.49,11.06 v62.79,11.36 | RLED1.A 75.43,7.73 76.23,7.73 v76.85,7.11
  Bottom 0.305: v62.79,11.36 70.14,11.36 73.02,8.48 74.68,8.48 76.05,7.11 v76.85,7.11
RADIO_LED2  (via drill 0.4)
  Top 0.305: 78.21,7.78 RLED2.A 79.51,7.76 v79.96,7.31 | MSP1.13 61.23,11.57 v61.71,12.05
  Bottom 0.305: v61.71,12.05 70.57,12.05 73.47,9.15 74.97,9.15 75.73,8.39 77.17,8.39 78.25,7.31 v79.96,7.31
RADIO_UFOP_GATE
  Top 0.305: U9.6 67.32,5.68 63.44,9.56 MSP1.9
RADIO_UFOP_INT  (via drill 0.4)
  Top 0.305: MSP1.10 v64,10.07 64.35,9.72 66.86,9.72 67.37,9.21 67.37,8.62 68.27,7.72 U10.7 | v58.62,1.51 57.11,1.51 ZENER.CATHODE
  Bottom 0.305: v64,10.07 64,10 58,4 58,2.13 v58.62,1.51
RADIO_UFOP_VCC
  Top 0.305: U9.1 67.32,1.36 67.93,0.75 79.57,0.75 80.61,1.79 80.61,3.16 81.22,3.77 92.05,3.77 92.69,4.41 92.69,5.54 91.31,6.92 91.31,8.51 90.5,9.32 86.6,9.32 84.92,11 J3.3
REF  (via drill 0.4)
  Top 0.305: U10.6 68.44,8.22 68.08,8.58 68.1,8.58 v68.1,8.97 | U10.2 v72.38,7.72 | R20.2 83.99,4.79 R19.1 82.12,4.79 80.61,6.3 | 80.61,6.3 81.53,7.22 81.53,9.32 81.09,9.76 U7.2 | 80.61,6.3 v79.99,6.3 | U7.6 76.47,10.26 v76.05,10.68
  Bottom 0.305: v68.1,8.97 68.1,8.56 68.94,7.72 v72.38,7.72 74.31,7.72 75.73,6.3 v79.99,6.3 80.3,6.3 81,7 81,7.59 80.57,8.02 78.37,8.02 77.41,8.98 77.41,9.67 76.4,10.68 v76.05,10.68
RLED2
  Top 0.305: R26.1 RLED2.C
RST  (via drill 0.4)
  Top 0.305: MSP1.29 53.71,21.68 C3.2 53,22.09 53,22 52.55,21.55 v52.55,20.78 | J2.1 64.12,22.64 64.48,23 v67,23 67.21,23 67.79,22.42 R11.1 68.66,21.05 C11.1
  Bottom 0.305: 52.77,21 v52.55,20.78 55.27,23.5 62.71,23.5 63.21,23 v67,23
SCL_CTRL
  Top 0.305: 65.38,16.87 64.2,18.05 57.32,18.05 MSP1.25 | U8.2 65.38,16.87 | U5.2 73.85,16.74 | 73.85,16.74 73.08,17.51 66.02,17.51 65.38,16.87 | R16.1 75.83,19.45 | 75.83,19.45 75.83,18.41 76.17,18.07 77.55,18.07 78.31,17.31 85.54,17.31 87.08,15.77 U3.7 | 73.85,16.74 73.84,16.74 73.09,17.49 73.09,18.03 74.08,19.02 75.4,19.02 75.83,19.45
SCLK  (via drill 0.4)
  Top 0.305: MSP1.2 57.84,6.06 58.25,5.65 58.25,3.17 60.94,0.48 65.14,0.48 v65.68,1.02
  Bottom 0.305: J4.3 84.92,0.83 84.36,0.27 80.06,0.27 79.31,1.02 v65.68,1.02
SDA_CTRL  (via drill 0.4)
  Top 0.305: U8.3 64.88,16.62 64.45,17.05 62.2,17.05 61.92,16.77 | U5.3 73.35,16.56 73.04,16.87 70.85,16.87 70,16.02 v70,16 | 61.92,16.77 v61.92,15.1 | R17.1 77.67,19.06 v78.34,18.39 78.86,17.87 85.87,17.87 87.47,16.27 U3.6 | MSP1.24 57.72,17.08 58.21,17.57 61.12,17.57 61.92,16.77
  Bottom 0.305: v78.34,18.39 77.67,18.39 76.83,17.55 76.83,15.44 76.42,15.03 75.24,15.03 75.23,15.02 74.27,15.98 70.02,15.98 v70,16 | 69.98,15.98 v70,16 | v61.92,15.1 69.1,15.1 v70,16
SOLAR1+  (via drill 0.4)
  Top 0.305: D1.A v10.61,12.12 | MSP1.74 40.55,6.06 40.18,5.69 v40.18,5.14 | v34.05,2.02 35.71,2.02 C1.1
  Bottom 0.305: 18.26,6.38 18.17,6.38 JP5.2 | v10.61,12.12 12.52,12.12 18.26,6.38 | 18.26,6.38 29.8,6.38 30.29,5.89 30.29,3.17 31.44,2.02 v34.05,2.02 38.95,2.02 40.18,3.25 v40.18,5.14
SOLAR1-
  Bottom 0.305: JP3.2 9.72,4.82 10.96,3.58 14.73,3.58 15.86,2.45 JP5.1
SOLAR2+
  Top 0.305: JP3.3 9.79,7.36 10.94,6.21 10.94,4.18 11.58,3.54 15.51,3.54 15.75,3.78 17.94,3.78 | 17.94,3.78 18.11,3.78 JP5.4 | MSP1.73 39.82,6.57 38.97,5.72 38.97,1.49 38.07,0.59 18.57,0.59 18.01,1.15 18.01,3.71 17.94,3.78
SOLAR2-
  Bottom 0.305: JP5.3 18.75,2.45 17.56,3.64 16.11,3.64 14.93,4.82 JP2.2
SOLAR3+
  Top 0.305: JP2.3 19.49,7.36 JP5.6 23.08,3.76 35.88,3.76 39.19,7.07 MSP1.72
SOLAR3-
  Bottom 0.305: JP5.5 21.86,2.78 22.84,3.76 26.64,3.76 JP7.2
SOLAR4+
  Top 0.305: JP5.8 25.33,4.99 JP7.3 30.12,5.58 30.12,5.18 30.79,4.51 35.5,4.51 38.57,7.58 MSP1.71
SOLAR5+
  Top 0.305: D2.A 8.82,15.66 10.85,17.69 14.61,17.69 JP4.8 17.13,20.21 17.13,22.5 17.75,23.12 38,23.12 39.52,21.6 39.52,17.88 | 39.52,17.88 40.32,17.08 MSP1.52 | C2.1 38.63,18.77 39.52,17.88
SOLAR5-
  Top 0.305: JP6.2 13.33,18.95 JP4.7
SOLAR6+  (via drill 0.4)
  Top 0.305: JP6.3 15.87,16.41 JP4.6 | MSP1.53 39.43,16.57 v39,17
  Bottom 0.305: JP4.6 19.73,17.67 32.02,17.67 32.67,18.32 32.67,20.21 33.29,20.83 37.56,20.83 38.33,20.06 38.33,17.67 v39,17
SOLAR6-
  Top 0.305: JP4.5 19.69,20.25 25.38,20.25 JP8.2
SOLAR7+
  Top 0.305: JP4.4 23.51,16.43 JP8.3 26.66,15.75 27.41,15 38.77,15 39.33,15.56 MSP1.55
SOLAR7-
  Bottom 0.305: JP4.3 20.97,21.13 21.9,20.2 28.97,20.2 JP9.2
SOLAR8+
  Top 0.305: JP4.2 23.51,18.94 24.71,17.74 28.89,17.74 JP9.3 30.56,16.07 MSP1.54
TEST
  Top 0.305: MSP1.28 54.21,22.21 55,23 58.25,23 58.84,22.41 58.84,19.84 59.38,19.3 61.11,19.3 61.58,19.77 J2.6
TRIG  (via drill 0.4)
  Top 0.305: MSP1.22 57.91,16.07 v58.74,16.9
  Bottom 0.305: J1.4 87.01,23.55 74.43,23.55 73.51,22.63 73.51,21.31 72.25,20.05 68.1,20.05 66.63,18.58 65,18.58 63.99,17.57 59.41,17.57 v58.74,16.9
VCC  (via drill 0.4)
  Top 0.305: 55.39,20.88 C6.1 58.16,18.51 R11.2 69.2,18.51 69.95,19.26 71.29,19.26 72.05,20.02 72.05,21.7 72.91,22.56 R16.2 R17.2 78.8,22.56 79.44,21.92 79.44,20.7 80.16,19.98 92.43,19.98 93.24,19.17 93.24,15.45 93.06,15.27 U3.13 92.76,15.27 93.19,14.84 93.19,8.05 v92.27,7.13 | C7.1 MSP1.58 | v90.15,7.54 88.53,7.54 U4.1 | HI-LO.5 38.06,12.37 | v39,9.48 38.19,9.48 LO-HI.5 | MSP1.79 C9.1 44.73,2.12 44.73,1.89 45.73,1.89 v46.13,2.29 | MSP1.27 54.72,20.21 55.39,20.88 | 55.39,20.88 55.39,21.98 v55.63,22.22 | MSP1.99 54.72,2.83 54.48,2.59 53.12,2.59 52.7,2.17 C8.1 52.06,1.63 v51.51,2.18
  Top 0.406: S1.2 3.9,9.27 4.38,8.79 26.56,8.79 28.12,10.35 v28.55,10.35 30.08,10.35 30.17,10.26 | 38.54,14.47 35.63,14.47 34.99,13.83 R9.1 34.99,12.83 34.6,12.44 32.26,12.44 R8.1 30.17,10.35 30.17,10.26 | 38.54,14.47 39.34,14.47 C7.1 | 30.17,10.26 30.17,9.79 R3.1 | HI-LO.5 37.79,13.72 38.54,14.47
  Bottom 0.305: v92.27,7.13 90.56,7.13 v90.15,7.54 | v28.55,10.35 38.13,10.35 v39,9.48 | v55.63,22.22 55.63,21.39 54.02,19.78 52.26,19.78 50.2,21.84 45.03,21.84 43.22,20.03 43.22,11.41 41.13,9.32 39.16,9.32 v39,9.48 | v39,9.48 39,9.42 v46.13,2.29 46.13,1.59 46.52,1.2 51.17,1.2 51.51,1.54 v51.51,2.18
VIN  (via drill 0.4)
  Top 0.305: U1.4 U1.1 9.09,20.65 | 73.54,8.73 71.46,10.81 71.46,12.16 70.84,12.78 R24.1 69.5,14.43 68.12,15.8 U8.1 65.88,16.17 66.37,16.66 v67.03,16.66 | U10.8 69,6.82 69.45,6.36 v70.5,6.36 | v73.54,6.36 73.54,8.73 | 73.54,8.73 74.07,8.73 R22.1 74.86,9.29 75.07,9.08 77,9.08 U7.8 | 9.09,20.65 9.52,21.08 9.52,22.14 v9.99,22.61 | U2.4 9.39,17.64 9.77,18.02 9.77,19.97 9.09,20.65 | J2.4 62.85,20.31 v63.84,19.32 | U5.1 v74.35,17.34 | v47.61,23.12 47.61,22.2 v48.91,20.9
  Bottom 0.305: v70.5,6.36 v73.54,6.36 | v9.99,22.61 9.99,23.08 10.37,23.46 47.27,23.46 v47.61,23.12 | v63.84,19.32 63.84,18.6 63.52,18.28 56.35,18.28 | 56.35,18.28 51.91,18.28 49.29,20.9 v48.91,20.9 | 56.35,18.28 58.55,16.08 65.4,16.08 65.98,16.66 v67.03,16.66 68.37,18 74,18 74.35,17.65 v74.35,17.34
WP_CTRL_ECHO  (via drill 0.4)
  Top 0.305: v60.19,12.78 58.41,12.77 57.72,12.08 MSP1.14 | U5.9 v72.85,11.2
  Bottom 0.305: v60.19,12.78 69.47,12.77 71.28,12.77 v72.85,11.2
WP_CTRL_RADIO
  Top 0.305: MSP1.11 63.58,10.58 64.38,11.38 U8.9

### Text on the board
tPlace: uC | uC | uC | ECHO | TRIG | VCC | + | Harvest | CS | GDO1 | + | Batt | MOSI | SCLK | MISO | GDO2 | uC | uC | uC | Vcc | GND
bPlace: Clemson University / PERSIST LAB / Waldo Rev. B / 02/20/2017 / Designed by: / Harsh Desai